# Altium project system-schematic.PrjPcb
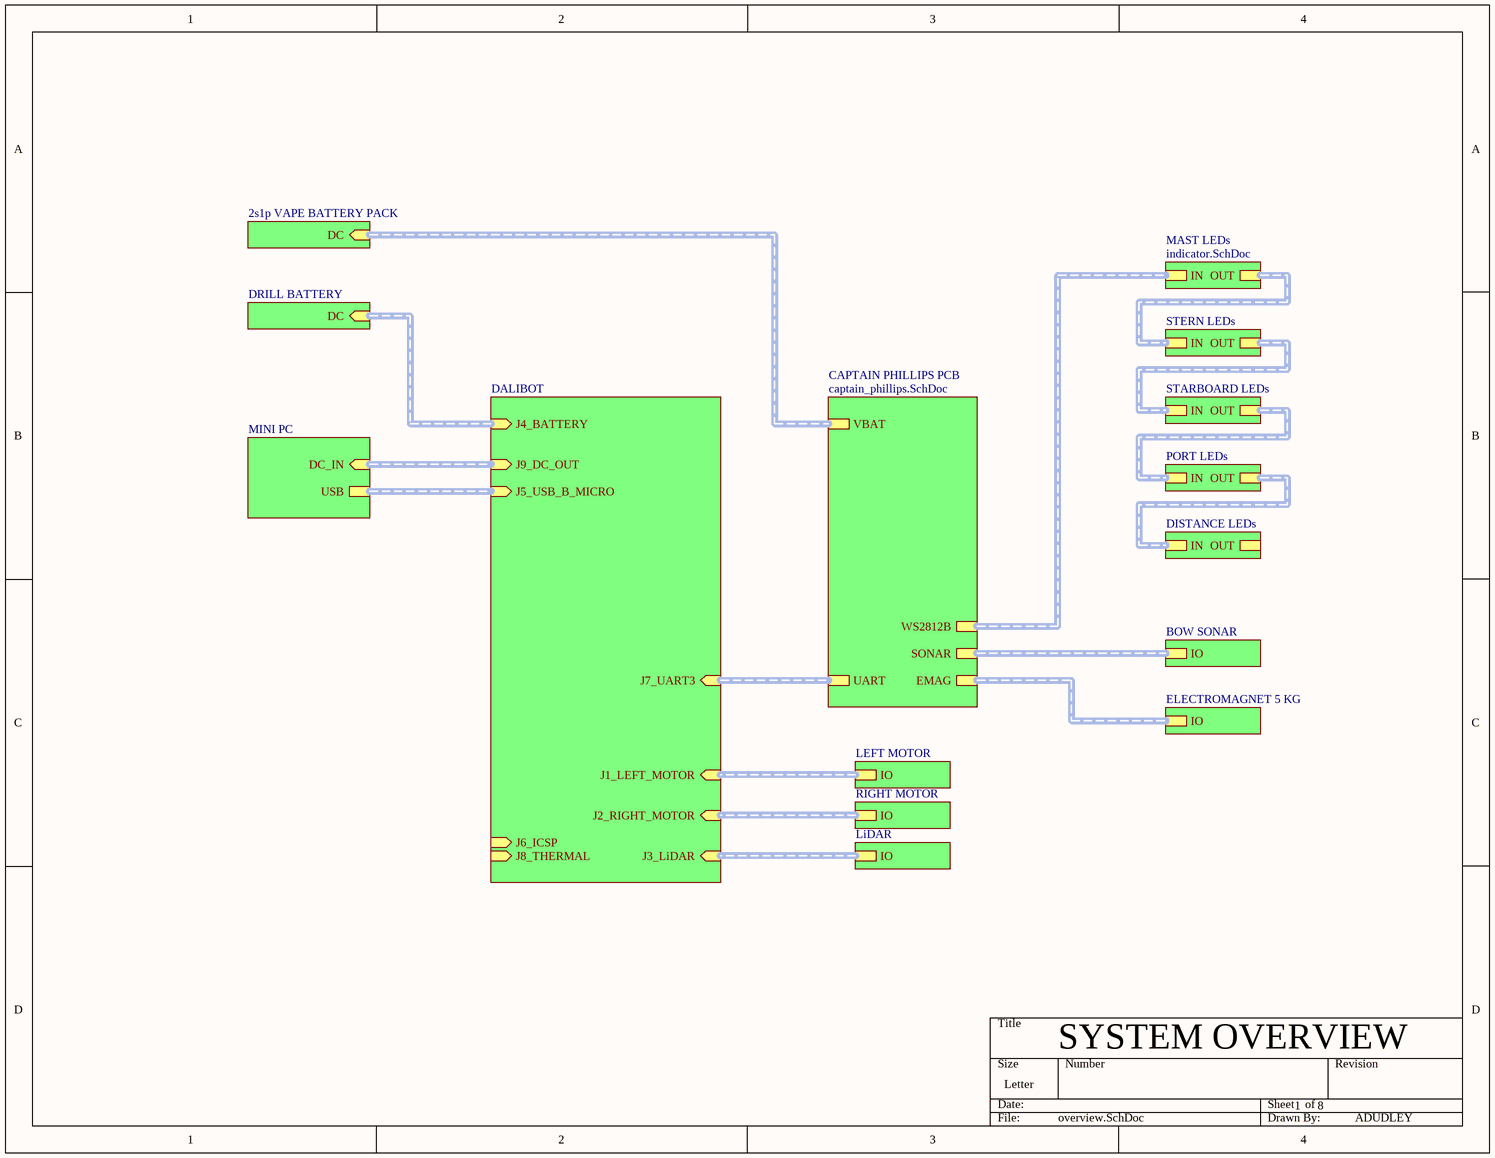
[diagram p0: overview.SchDoc]
4 sheets, 20 parts. Net scope: hierarchical (ports join the sheet entries above them; power ports are global).
Sheets:
  overview.SchDoc
    MAST LEDs = indicator.SchDoc
    PORT LEDs = indicator.SchDoc
    STERN LEDs = indicator.SchDoc
    STARBOARD LEDs = indicator.SchDoc
    CAPTAIN PHILLIPS PCB = captain_phillips.SchDoc
      WS2812B CONTROL = ws2812b.SchDoc
    DISTANCE LEDs = indicator.SchDoc

## Sheet overview.SchDoc
size Letter; SheetNumber: 1; SheetTotal: 8

### Sub-sheets
2s1p VAPE BATTERY PACK = File Name (file not in this document): DC (in)
BOW SONAR = File Name (file not in this document): IO
CAPTAIN PHILLIPS PCB = captain_phillips.SchDoc: SONAR, UART, WS2812B, EMAG, VBAT
DALIBOT = File Name (file not in this document): J1_LEFT_MOTOR (in), J2_RIGHT_MOTOR (in), J3_LiDAR (in), J4_BATTERY (in), J5_USB_B_MICRO (in), J6_ICSP (in), J7_UART3 (in), J8_THERMAL (in), J9_DC_OUT (in)
DISTANCE LEDs = indicator.SchDoc: OUT, IN
DRILL BATTERY = File Name (file not in this document): DC (in)
ELECTROMAGNET 5 KG = File Name (file not in this document): IO
LEFT MOTOR = File Name (file not in this document): IO
LiDAR = File Name (file not in this document): IO
MAST LEDs = indicator.SchDoc: IN, OUT
MINI PC = File Name (file not in this document): USB, DC_IN (in)
PORT LEDs = indicator.SchDoc: OUT, IN
RIGHT MOTOR = File Name (file not in this document): IO
STARBOARD LEDs = indicator.SchDoc: OUT, IN
STERN LEDs = indicator.SchDoc: OUT, IN

### Buses and harness runs
harness sheet 2s1p VAPE BATTERY PACK/DC = sheet CAPTAIN PHILLIPS PCB/VBAT
harness sheet BOW SONAR/IO = sheet CAPTAIN PHILLIPS PCB/SONAR
harness sheet CAPTAIN PHILLIPS PCB/EMAG = sheet ELECTROMAGNET 5 KG/IO
harness sheet CAPTAIN PHILLIPS PCB/UART = sheet DALIBOT/J7_UART3
harness sheet CAPTAIN PHILLIPS PCB/WS2812B = sheet MAST LEDs/IN
harness sheet DALIBOT/J1_LEFT_MOTOR = sheet LEFT MOTOR/IO
harness sheet DALIBOT/J2_RIGHT_MOTOR = sheet RIGHT MOTOR/IO
harness sheet DALIBOT/J3_LiDAR = sheet LiDAR/IO
harness sheet DALIBOT/J4_BATTERY = sheet DRILL BATTERY/DC
harness sheet DALIBOT/J5_USB_B_MICRO = sheet MINI PC/USB
harness sheet DALIBOT/J9_DC_OUT = sheet MINI PC/DC_IN
harness sheet DISTANCE LEDs/IN = sheet PORT LEDs/OUT
harness sheet MAST LEDs/OUT = sheet STERN LEDs/IN
harness sheet PORT LEDs/IN = sheet STARBOARD LEDs/OUT
harness sheet STARBOARD LEDs/IN = sheet STERN LEDs/OUT

### Notes on the sheet
- SYSTEM OVERVIEW
- ADUDLEY

## Sheet indicator.SchDoc
size Letter; SheetNumber: 8; SheetTotal: 8
Used 5 times, as channels MAST LEDs, PORT LEDs, STERN LEDs, STARBOARD LEDs, DISTANCE LEDs. Parts and nets are listed once, with the designators drawn on the sheet.
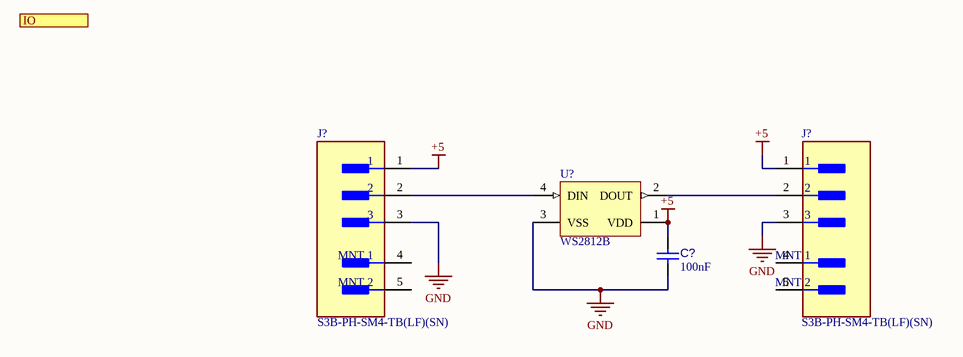
[diagram p1: indicator.SchDoc]

### Parts
(Parts that share a designator on the sheet are numbered #1, #2 ... from top to bottom, then left to right.)
C?  value 100nF  [3]  (hidden comment: Capacitor 100 nF 10 % 50V 0603)
J?#1  S3B-PH-SM4-TB(LF)(SN)  [FP-S3B-PH-SM4-TB_LF_SN-MFG]
J?#2  S3B-PH-SM4-TB(LF)(SN)  [FP-S3B-PH-SM4-TB_LF_SN-MFG]
U?  WS2812B  [ADAI-WS2812B_V]

### Ports
IO

### Nets
+5: C?.2 J?#1.1 J?#2.1 U?.1(VDD)
GND: C?.1 J?#1.3 J?#2.3 U?.3(VSS)
NetJ?#1_2: J?#1.2 U?.4(DIN)
NetJ?#2_2: J?#2.2 U?.2(DOUT)

Not connected (* = marked no-connect by the designer): J?#1 4(MNT_1) 5(MNT_2); J?#2 4(MNT_1) 5(MNT_2)

### Channels
MAST LEDs: designators C?=C?_MAST_LEDs J?=J?_MAST_LEDs#1 J?=J?_MAST_LEDs#2 U?=U?_MAST_LEDs; ports IO=open
PORT LEDs: designators C?=C?_PORT_LEDs J?=J?_PORT_LEDs#1 J?=J?_PORT_LEDs#2 U?=U?_PORT_LEDs; ports IO=open
STERN LEDs: designators C?=C?_STERN_LEDs J?=J?_STERN_LEDs#1 J?=J?_STERN_LEDs#2 U?=U?_STERN_LEDs; ports IO=open
STARBOARD LEDs: designators C?=C?_STARBOARD_LEDs J?=J?_STARBOARD_LEDs#1 J?=J?_STARBOARD_LEDs#2 U?=U?_STARBOARD_LEDs; ports IO=open
DISTANCE LEDs: designators C?=C?_DISTANCE_LEDs J?=J?_DISTANCE_LEDs#1 J?=J?_DISTANCE_LEDs#2 U?=U?_DISTANCE_LEDs; ports IO=open

### Library data of the parts
C? = CMP-001-00092-5: CAP CER 100 nF 50V X7R 0603; Capacitor Type: Ceramic; Tolerance: 10%; Voltage Rating: 50V; Case/Package: 0603; LCSC Part Number: C14663
J?#1 J?#2 = CMP-2000-07023-2: CONN HEADER SMD R/A 3POS 2MM; Voltage Rating: 100V; Gender: Male; Max Current Rating: 2A; Number of Contacts: 3; Insulation Resistance: 1GR; Contact Resistance: 10mR; Termination: Solder; Orientation: Right Angle; Insulation Color: Natural; Flammability Rating: UL94 V-0; Width: 5mm; Lead Free: Lead Free; Mount: Surface Mount; Max Operating Temperature: 85°C; Connector Type: Header; Fastening Type: Detent; Max Voltage Rating (DC): 100V; Housing Material: Polyamide; Number of Rows: 1; Housing Color: Beige; Contact Plating: Tin; Contact Shape: Square; Working Voltage: 100V; Contact Material: Copper Alloy; Contact Mating Length: 0.13inch; Contact Type: Male Pin; Max Voltage Rating (AC): 100V; Packaging: Tape and Reel; Min Operating Temperature: -25°C; Number of Positions: 3; REACH SVHC: No SVHC; Contact Finish - Mating: TIN; Color: Natural; Length: 9.9mm; Insulation Material: Nylon; Depth: 7.6mm; Current Rating: 2A; Material: Polyamide; Voltage Rating (AC): 100V; Pitch: 2mm; Series: PH; Height: 9.4mm; Number of Poles: 3; Lead Pitch: 2mm
U? = CMP-007-00035-2: Intelligent Control LED Integrated Light Source, 3.5 to 5.3 V, -25 to 80 degC, 4-Pin SMD, RoHS, Bulk; Manufacturer: Adafruit Industries; Datasheet URL: https://cdn-shop.adafruit.com/datasheets/WS2812B.pdf; Manufacturer URL: https://www.adafruit.com/; Datasheet Version: May-13; Case/Package: WS2812B; Mounting Technology: SM; RoHS Compliant: False; Package Description: 4-Pin Surface Mount Device, Body 5 x 5 mm, Pitch 3.3 mm; Package Reference: WS2812B

## Sheet captain_phillips.SchDoc
size Letter; SheetNumber: 2; SheetTotal: 8
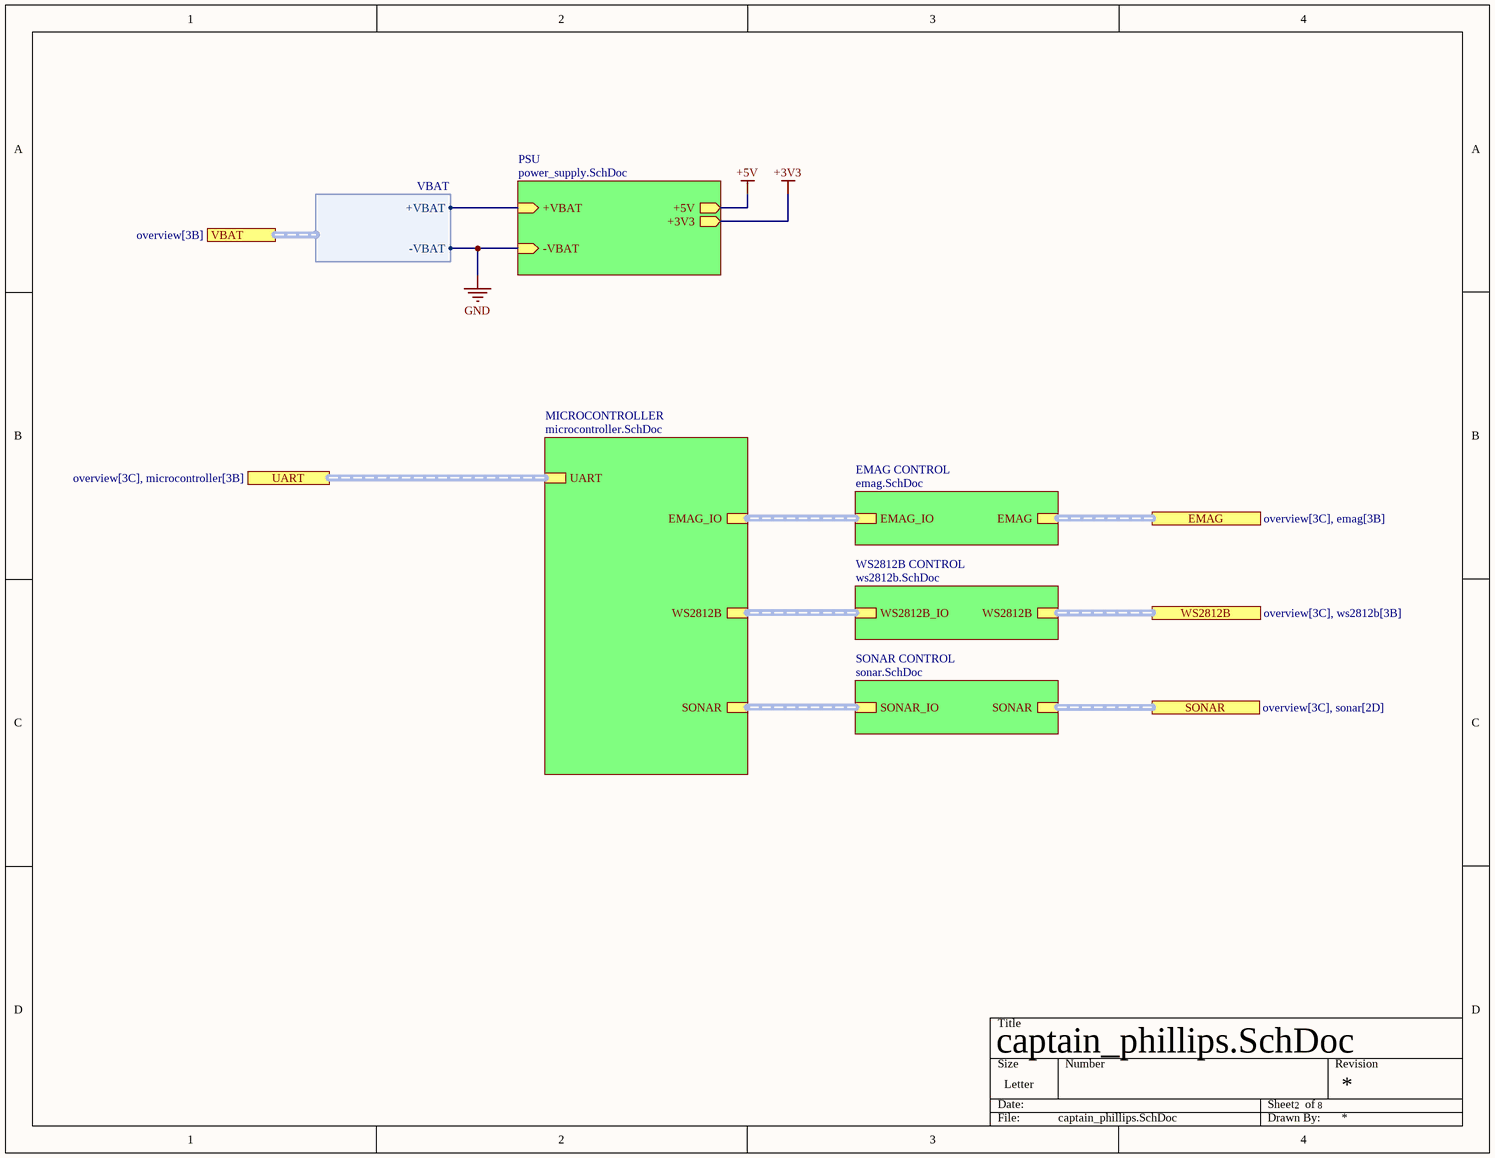
[diagram p2: captain_phillips.SchDoc]

### Sub-sheets
EMAG CONTROL = emag.SchDoc (file not in this document): EMAG, EMAG_IO
MICROCONTROLLER = microcontroller.SchDoc (file not in this document): UART, SONAR, WS2812B, EMAG_IO
PSU = power_supply.SchDoc (file not in this document): +VBAT (in), -VBAT (in), +5V (out), +3V3 (out)
SONAR CONTROL = sonar.SchDoc (file not in this document): SONAR_IO, SONAR
WS2812B CONTROL = ws2812b.SchDoc: WS2812B_IO, WS2812B

### Ports
EMAG (see overview[3C], emag[3B]), SONAR (see overview[3C], sonar[2D]), UART (see overview[3C], microcontroller[3B]), VBAT (harness VBAT, see overview[3B]), WS2812B (see overview[3C], ws2812b[3B])

### Harnesses
VBAT: +VBAT, -VBAT

### Nets
+3V3: sheet PSU/+3V3
+5V: sheet PSU/+5V
GND: sheet PSU/-VBAT, port VBAT.-VBAT
(unnamed): sheet PSU/+VBAT, port VBAT.+VBAT

### Buses and harness runs
harness port EMAG = sheet EMAG CONTROL/EMAG
harness port SONAR = sheet SONAR CONTROL/SONAR
harness port UART = sheet MICROCONTROLLER/UART
harness port WS2812B = sheet WS2812B CONTROL/WS2812B
harness sheet EMAG CONTROL/EMAG_IO = sheet MICROCONTROLLER/EMAG_IO
harness sheet MICROCONTROLLER/SONAR = sheet SONAR CONTROL/SONAR_IO
harness sheet MICROCONTROLLER/WS2812B = sheet WS2812B CONTROL/WS2812B_IO

## Sheet ws2812b.SchDoc
size Letter; SheetNumber: 6; SheetTotal: 8
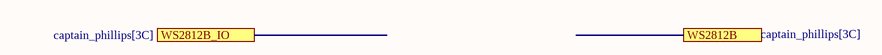
[diagram p3: ws2812b.SchDoc]

### Ports
WS2812B (see captain_phillips[3C]), WS2812B_IO (see captain_phillips[3C])

## Nets that join several sheets
+5: MAST LEDs (C?_MAST_LEDs.2 J?_MAST_LEDs#1.1 J?_MAST_LEDs#2.1 U?_MAST_LEDs.1), PORT LEDs (C?_PORT_LEDs.2 J?_PORT_LEDs#1.1 J?_PORT_LEDs#2.1 U?_PORT_LEDs.1), STERN LEDs (C?_STERN_LEDs.2 J?_STERN_LEDs#1.1 J?_STERN_LEDs#2.1 U?_STERN_LEDs.1), STARBOARD LEDs (C?_STARBOARD_LEDs.2 J?_STARBOARD_LEDs#1.1 J?_STARBOARD_LEDs#2.1 U?_STARBOARD_LEDs.1), DISTANCE LEDs (C?_DISTANCE_LEDs.2 J?_DISTANCE_LEDs#1.1 J?_DISTANCE_LEDs#2.1 U?_DISTANCE_LEDs.1)
GND: MAST LEDs (C?_MAST_LEDs.1 J?_MAST_LEDs#1.3 J?_MAST_LEDs#2.3 U?_MAST_LEDs.3), PORT LEDs (C?_PORT_LEDs.1 J?_PORT_LEDs#1.3 J?_PORT_LEDs#2.3 U?_PORT_LEDs.3), STERN LEDs (C?_STERN_LEDs.1 J?_STERN_LEDs#1.3 J?_STERN_LEDs#2.3 U?_STERN_LEDs.3), STARBOARD LEDs (C?_STARBOARD_LEDs.1 J?_STARBOARD_LEDs#1.3 J?_STARBOARD_LEDs#2.3 U?_STARBOARD_LEDs.3), DISTANCE LEDs (C?_DISTANCE_LEDs.1 J?_DISTANCE_LEDs#1.3 J?_DISTANCE_LEDs#2.3 U?_DISTANCE_LEDs.3)